# EAGLE design untitled (EAGLE 7.5.0)
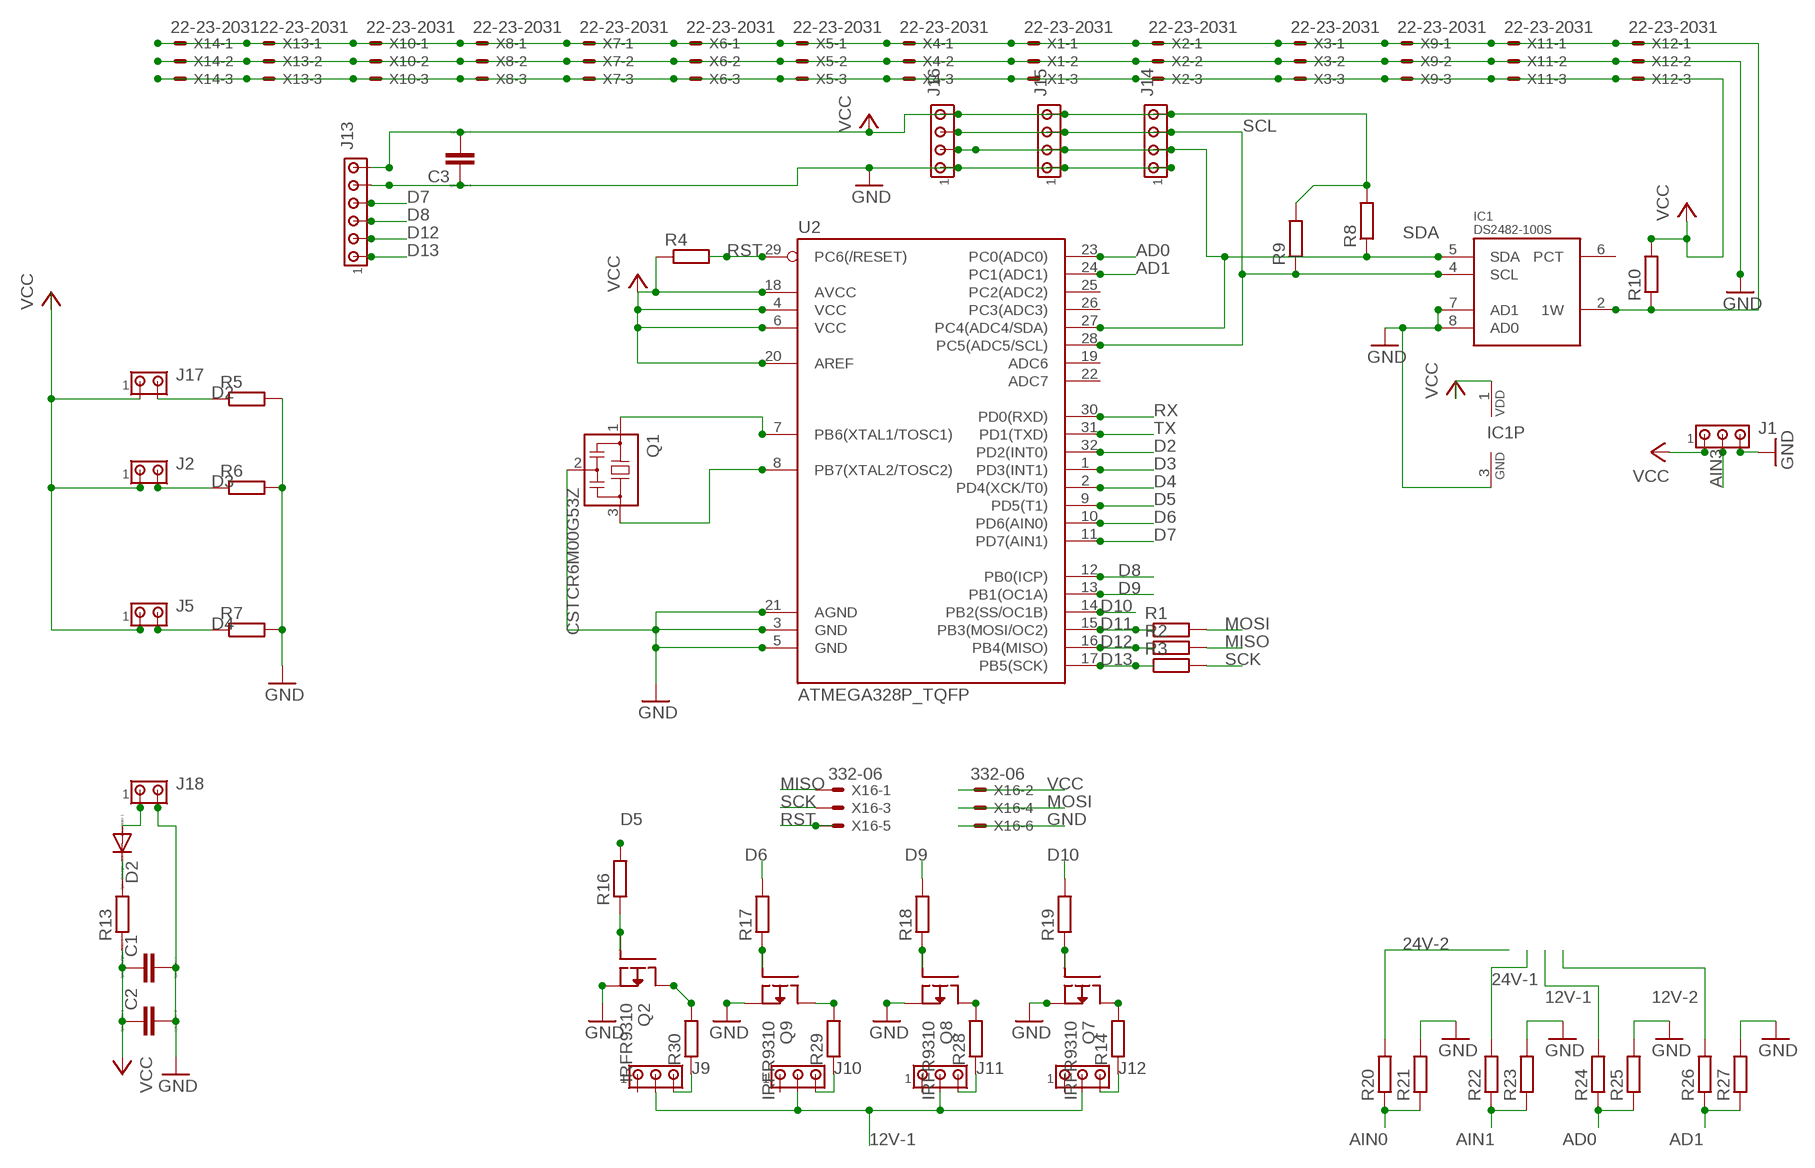
[diagram p0: schematic, sheet 1, part 1 of 2]
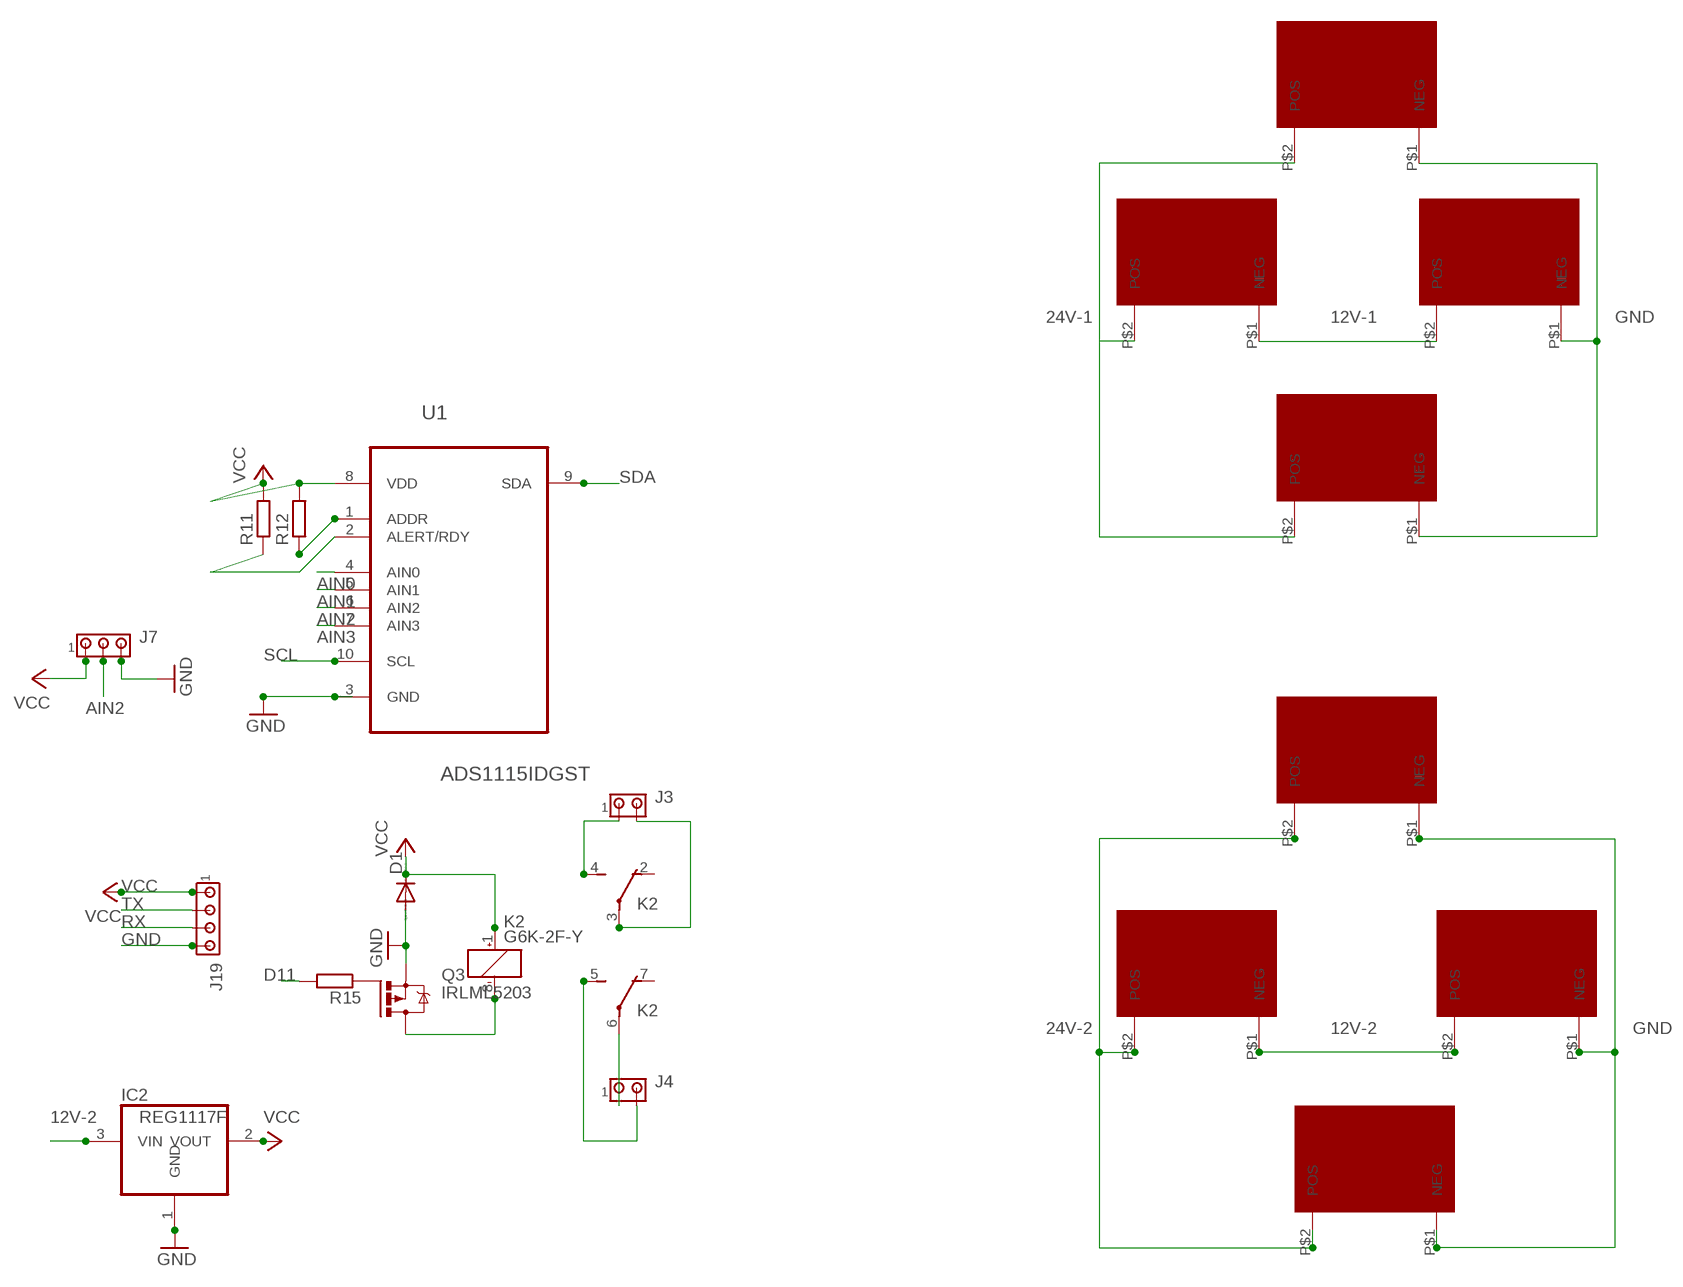
[diagram p1: schematic, sheet 1, part 2 of 2]

## Parts
C1  CC1206  [C1206]
C2  CC1206  [C1206]
C3  CC1206  [C1206]
D1  DIODE-DO214AA  [DO214AA]
D2  DIODE-DO214AA  [DO214AA]
IC1  DS2482-100S  [SO08]
IC2  REG1117F  [DD-3]
J1  MTA03-100  [10X03MTA]
J2  MTA02-100  [10X02MTA]
J3  MTA02-100  [10X02MTA]
J4  MTA02-100  [10X02MTA]
J5  MTA02-100  [10X02MTA]
J7  MTA03-100  [10X03MTA]
J9  MTA03-100  [10X03MTA]
J10  MTA03-100  [10X03MTA]
J11  MTA03-100  [10X03MTA]
J12  MTA03-100  [10X03MTA]
J13  MTA06-100  [10X06MTA]
J14  MTA04-100  [10X04MTA]
J15  MTA04-100  [10X04MTA]
J16  MTA04-100  [10X04MTA]
J17  MTA02-100  [10X02MTA]
J18  MTA02-100  [10X02MTA]
J19  MTA04-100  [10X04MTA]
K2  G6K-2F-Y  [G6K-2F-Y]
Q1  CSTCR6M00G53Z  [CSTCR6M]
Q2  IRFR9310  [TO252]
Q3  IRLML5203  [MICRO3]
Q7  IRFR9310  [TO252]
Q8  IRFR9310  [TO252]
Q9  IRFR9310  [TO252]
R1  R-EU_R0603  [R0603]
R2  R-EU_R0603  [R0603]
R3  R-EU_R0603  [R0603]
R4  R-EU_R0603  [R0603]
R5  R-EU_R0603  [R0603]
R6  R-EU_R0603  [R0603]
R7  R-EU_R0603  [R0603]
R8  R-EU_R0603  [R0603]
R9  R-EU_R0603  [R0603]
R10  R-EU_R0603  [R0603]
R11  R-EU_R0603  [R0603]
R12  R-EU_R0603  [R0603]
R13  RR2010  [R2010]
R14  R-EU_M1206  [M1206]
R15  R-EU_R0603  [R0603]
R16  R-EU_R0603  [R0603]
R17  R-EU_R0603  [R0603]
R18  R-EU_R0603  [R0603]
R19  R-EU_R0603  [R0603]
R20  R-EU_R0603  [R0603]
R21  R-EU_R0603  [R0603]
R22  R-EU_R0603  [R0603]
R23  R-EU_R0603  [R0603]
R24  R-EU_R0603  [R0603]
R25  R-EU_R0603  [R0603]
R26  R-EU_R0603  [R0603]
R27  R-EU_R0603  [R0603]
R28  R-EU_M1206  [M1206]
R29  R-EU_M1206  [M1206]
R30  R-EU_M1206  [M1206]
U1  ADS1115IDGST  [SOP50P490X110-10N]
U2  ATMEGA328P_TQFP  [TQFP32-08]
U$1  XT60  [XT60]
U$2  XT60  [XT60]
U$3  XT60  [XT60]
U$4  XT60  [XT60]
U$5  XT60  [XT60]
U$6  XT60  [XT60]
U$7  XT60  [XT60]
U$8  XT60  [XT60]
X1  22-23-2031  [22-23-2031]
X2  22-23-2031  [22-23-2031]
X3  22-23-2031  [22-23-2031]
X4  22-23-2031  [22-23-2031]
X5  22-23-2031  [22-23-2031]
X6  22-23-2031  [22-23-2031]
X7  22-23-2031  [22-23-2031]
X8  22-23-2031  [22-23-2031]
X9  22-23-2031  [22-23-2031]
X10  22-23-2031  [22-23-2031]
X11  22-23-2031  [22-23-2031]
X12  22-23-2031  [22-23-2031]
X13  22-23-2031  [22-23-2031]
X14  22-23-2031  [22-23-2031]
X16  332-06  [332-06]

## Nets
12V-1: J9.2 J10.2 J11.2 J12.2 R24.2 U$1.P$1(NEG) U$2.P$2(POS)
12V-2: IC2.3(VIN) R26.2 U$6.P$1(NEG) U$7.P$2(POS)
24V-1: R22.2 U$1.P$2(POS) U$3.P$2(POS) U$4.P$2(POS)
24V-2: R20.2 U$5.P$2(POS) U$6.P$2(POS) U$8.P$2(POS)
AD0: R24.1 R25.1 U2.23(PC0(ADC0))
AD1: R26.1 R27.1 U2.24(PC1(ADC1))
AIN0: R20.1 R21.1 U1.4(AIN0)
AIN1: R22.1 R23.1 U1.5(AIN1)
AIN2: J7.2 U1.6(AIN2)
AIN3: J1.2 U1.7(AIN3)
D2: J17.2 R5.1 U2.32(PD2(INT0))
D3: J2.2 R6.1 U2.1(PD3(INT1))
D4: J5.2 R7.1 U2.2(PD4(XCK/T0))
D5: R16.2 U2.9(PD5(T1))
D6: R17.2 U2.10(PD6(AIN0))
D7: J13.4 U2.11(PD7(AIN1))
D8: J13.3 U2.12(PB0(ICP))
D9: R18.2 U2.13(PB1(OC1A))
D10: R19.2 U2.14(PB2(SS/OC1B))
D11: R1.1 R15.2 U2.15(PB3(MOSI/OC2))
D12: J13.2 R2.1 U2.16(PB4(MISO))
D13: J13.1 R3.1 U2.17(PB5(SCK))
GND: C1.2 C2.2 C3.1 D1.A IC1.3(GND) IC1.7(AD1) IC1.8(AD0) IC2.1(GND) J1.3 J7.3 J13.5 J14.1 J15.1 J16.1 J18.2 J19.4 Q1.2 Q2.2(S) Q3.2(S) Q7.2(S) Q8.2(S) Q9.2(S) R5.2 R6.2 R7.2 R21.2 R23.2 R25.2 R27.2 U1.3(GND) U2.3(GND) U2.5(GND) U2.21(AGND) U$2.P$1(NEG) U$3.P$1(NEG) U$4.P$1(NEG) U$5.P$1(NEG) U$7.P$1(NEG) U$8.P$1(NEG) X1.2 X2.2 X3.2 X4.2 X5.2 X6.2 X7.2 X8.2 X9.2 X10.2 X11.2 X12.2 X13.2 X14.2 X16.6
MISO: R2.2 X16.1
MOSI: R1.2 X16.4
N$1: IC1.2(1W) R10.1 X1.1 X2.1 X3.1 X4.1 X5.1 X6.1 X7.1 X8.1 X9.1 X10.1 X11.1 X12.1 X13.1 X14.1
N$2: Q1.1 U2.7(PB6(XTAL1/TOSC1))
N$3: Q1.3 U2.8(PB7(XTAL2/TOSC2))
N$6: J9.3 R30.1
N$7: Q3.1(G) R15.1
N$8: K2.8(1:-) Q3.3(D)
N$9: Q9.3(D) R29.2
N$10: Q2.3(D) R30.2
N$11: Q8.3(D) R28.2
N$12: Q7.3(D) R14.2
N$13: R12.1 U1.1(ADDR)
N$14: J3.1 K2.4(2:S)
N$15: R11.1 U1.2(ALERT/RDY)
N$16: J10.3 R29.1
N$17: J11.3 R28.1
N$18: J12.3 R14.1
N$19: J3.2 K2.3(2:P)
N$20: J4.1 K2.6(3:P)
N$21: J4.2 K2.5(3:S)
N$22: D2.A J18.1
N$23: D2.C R13.2
N$26: Q2.1(G) R16.1
N$27: Q9.1(G) R17.1
N$28: Q8.1(G) R18.1
N$29: Q7.1(G) R19.1
RST: R4.2 U2.29(PC6(/RESET)) X16.5
RX: J19.3 U2.30(PD0(RXD))
SCK: R3.2 X16.3
SCL: IC1.4(SCL) J14.3 J15.3 J16.3 R9.1 U1.10(SCL) U2.28(PC5(ADC5/SCL))
SDA: IC1.5(SDA) J14.2 J15.2 J16.2 R8.1 U1.9(SDA) U2.27(PC4(ADC4/SDA))
TX: J19.2 U2.31(PD1(TXD))
VCC: C1.1 C2.1 C3.2 D1.C IC1.1(VDD) IC2.2(VOUT) J1.1 J2.1 J5.1 J7.1 J13.6 J14.4 J15.4 J16.4 J17.1 J19.1 K2.1(1:+) R4.1 R8.2 R9.2 R10.2 R11.2 R12.2 R13.1 U1.8(VDD) U2.4(VCC) U2.6(VCC) U2.18(AVCC) U2.20(AREF) X1.3 X2.3 X3.3 X4.3 X5.3 X6.3 X7.3 X8.3 X9.3 X10.3 X11.3 X12.3 X13.3 X14.3 X16.2
Unconnected: IC1.6(PCT) J9.1 J10.1 J11.1 J12.1 K2.2(2:O) K2.7(3:O) U2.19(ADC6) U2.22(ADC7) U2.25(PC2(ADC2)) U2.26(PC3(ADC3))

## Library data of the parts
C1-C3 = eagle-ltspice:C: CAPACITOR, European symbol; SPICEMODEL: NONE; SPICEPREFIX: C
D1 D2 = diode:DIODE-: DIODE
IC1 = 1wire:DS2482-100: I2C to 1-Wire Host Adapter/Line Driver This device is a onewire host and I2C interface in one chip. It provides the complete DC/AC requirements for onewire communication, including overdrive speed mode, but, unlike the DS2480B chip, no 12V EPROM programming. Notes: For overdrive speed and 5V EEPROM programming, an external active pullup circuit must be connected to the 1W, VDD and PCT pin. See the datasheet for details. The lower two I2C adress bits of the chip can be selected by external pins, so up to 4 chips may be connected to the same I2C bus. Author: Orginal device and description from Giovanni Varasano <giovanni.varasano@fastwebnet.it> Improved by Jan Kandziora <jjj@gmx.de>
IC2 = burr-brown:REG1117: 800mA and 1A Low Dropout (LDO) Positive Regulator 1.8V, 2.5V, 2.85V, 3.3V, 5V, and Adj; MF: TEXAS INSTRUMENTS; MPN: REG1117FAKTTT; OC_FARNELL: 1296120; OC_NEWARK: 87H2562
J1 J7 J9-J12 = con-amp:MTA03-100: AMP connector
J2-J5 J17 J18 = con-amp:MTA02-100: AMP connector
J13 = con-amp:MTA06-100: AMP connector Connection corrected 2014-09-19
J14-J16 J19 = con-amp:MTA04-100: AMP connector
K2 = relay:G6K: Low Signal Relay oeiwcsnts1.omron.com/.. D20G6K0100.pdf; MF: OMRON COMPONENTS USA; MPN: G6K-2F-Y DC3; OC_FARNELL: 1690316; OC_NEWARK: 89C6451
Q1 = murata-filter:CSTCR: Resonator Source: murata.co.jp; MPN: CSTCR6M00G53-R0; OC_FARNELL: 1170434; OC_NEWARK: 25M8759
Q2 Q7-Q9 = mosfet:IRFR9310: MOSFET, P, -400V, -1.8A, D-PAK IRFR9310 Parameters MOSFET, P, -400V, -1.8A, D-PAK Transistor Polarity: P Channel Continuous Drain Current Id: 1.8A Drain Source Voltage Vds: 400V On Resistance Rds(on): 7ohm Rds(on) Test Voltage Vgs: -10V Threshold Voltage Vgs: -4V Power Dissipation Pd: 50W Operating Temperature Min: -55°C Operating Temperature Max: 150°C Transistor Case Style: TO-252 No. of Pins: 3 MSL: MSL 1 - Unlimited Alternate Case Style: D-PAK Current Id Max: -1.8A Current Temperature: 25°C External Depth: 10.5mm External Length / Height: 2.55mm External Width: 6.8mm Full Power Rating Temperature: 25°C Junction to Case Thermal Resistance A: 2.5°C/W No. of Transistors: 1 Operating Temperature Range: -55°C to +150°C Pulse Current Idm: 7.2A Termination Type: SMD Voltage Vds Typ: -400V Voltage Vgs Max: 20V Voltage Vgs Rds on Measurement: -10V; MPN: IRFR9310PBF; OC_FARNELL: 8649910; PACKAGE: D-PACK; SUPPLIER: VISHAY
Q3 = transistor-power:IRLML5203: HEXFET P-Channel Power MOSFET
R1-R12 R15-R27 = resistor:R-EU_: RESISTOR, European symbol
R13 = eagle-ltspice:R: RESISTOR, European symbol; SPICEMODEL: NONE; SPICEPREFIX: R
R14 R28-R30 = rcl:R-EU_: RESISTOR, European symbol
U1 = Texas Instruments_By_element14_Batch_1:ADS1115IDGST: Analog-to-Digital Converter with Internal Reference; MPN: ADS1115IDGST; OC_FARNELL: 1762981; OC_NEWARK: 25R1241; PACKAGE: MSOP-10; SUPPLIER: Texas Instruments
U2 = SparkFun-DigitalIC:ATMEGA328P_TQFP; PROD_ID: IC-09069
U$1-U$8 = hans:XT60
X1-X14 = con-molex:22-23-2031: .100" (2.54mm) Center Header - 3 Pin; MF: MOLEX; MPN: 22-23-2031; OC_FARNELL: 1462950; OC_NEWARK: 30C0862
X16 = con-garry:332-06: 6 Pin - 2mm Dual Row Source: www.mpe-connector.de / garry_shortform_2012.pdf

## Net classes
0 default: width 0.152 mm, drill 0.508 mm, clearance 0.102 mm
1 supply: width 0.305 mm, drill 0.508 mm, clearance 0.203 mm

## Board
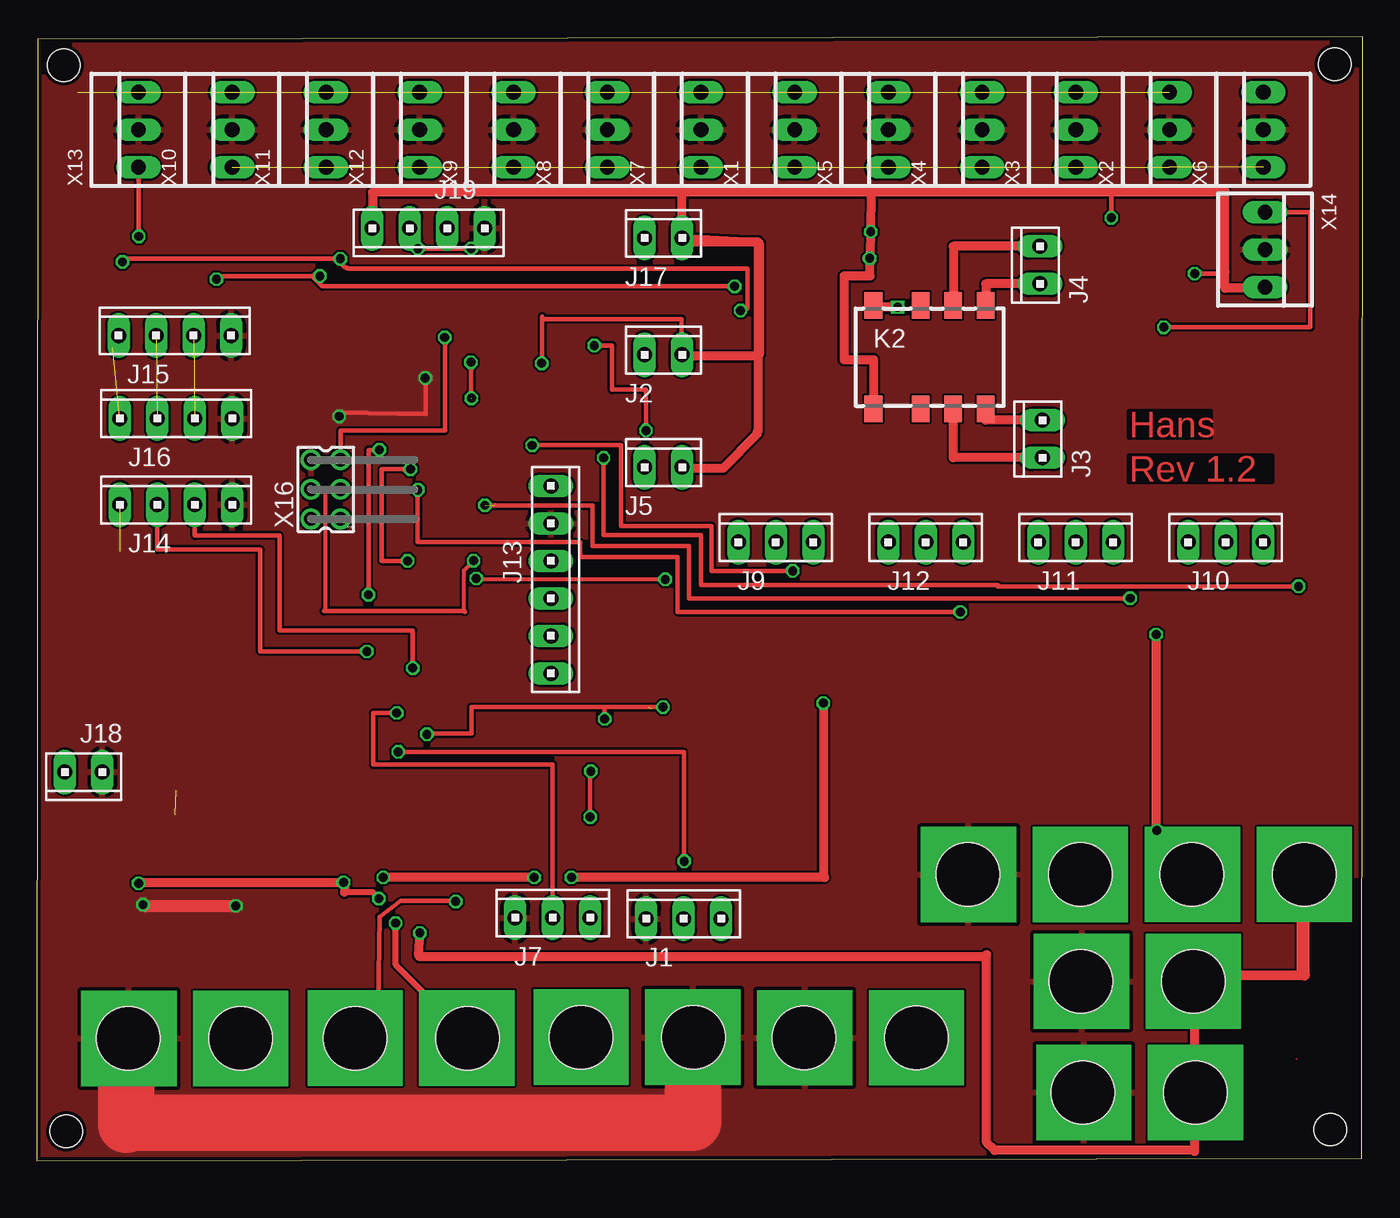
[diagram p2: board, top side]
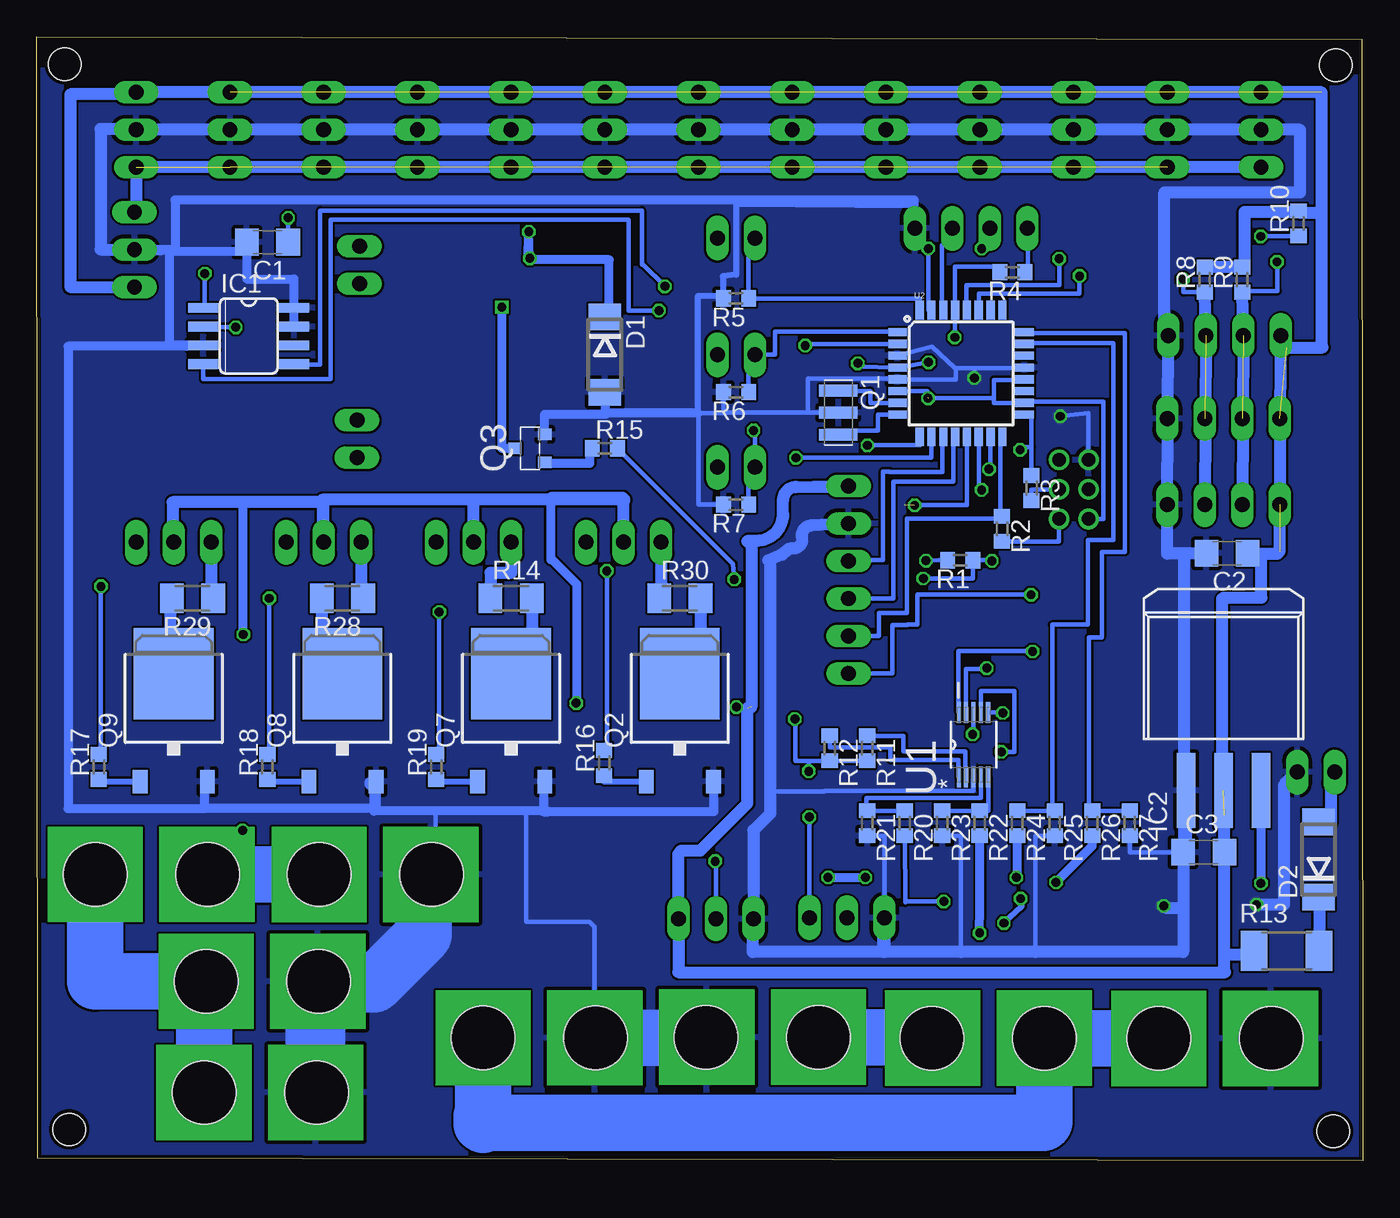
[diagram p3: board, bottom side, seen from below]

Size 89.82 x 76.15 mm. Coordinates in mm from the lower left corner, seen from the top.
Outline: 0,0 89.77,0.15 89.82,76.15 0.05,76 0,0
Copper layers (1*16): Top 0.035mm / dielectric 1.5mm / Bottom 0.035mm
Design rules "SeeedStudio_2layer_DRU_no_angle_20140221": minimum track width 6mil, minimum drill 12mil, track to track 6mil, track to pad 6mil, pad to pad 6mil, via to via 6mil, smd to smd 0mil, copper to edge 10mil, drill to drill 10mil, minimum pad ring 10mil, minimum via ring 6mil, stop-mask expansion 2mil, vias tented up to drill 100mil, thermal gap 10mil
Holes 2.2 mm at 1.82,74.23 87.94,74.3 87.63,2.11 1.98,1.99

### Footprints (pad centres in the part's own frame; a part is rotated, then mirrored left to right if it is on the bottom)
C1206 = smd 1.6 x 1.8: 1 -1.4,0; 2 1.4,0
DO214AA = smd 1.8 x 2.2: A 2.55,0; C -2.55,0
SO08 = smd 0.66 x 2.032: 1 -1.905,-3.073; 2 -0.635,-3.073; 3 0.635,-3.073; 4 1.905,-3.073; 5 1.905,3.073; 6 0.635,3.073; 7 -0.635,3.073; 8 -1.905,3.073
DD-3 = smd 1.27 x 5.08: 1 -2.54,-7.938; 2 0,-7.938; 3 2.54,-7.938
10X03MTA = drill 1.016 long: 1 2.54,0; 2 0,0; 3 -2.54,0
10X02MTA = drill 1.016 long: 1 1.27,0; 2 -1.27,0
10X06MTA = drill 1.016 long: 1 6.35,0; 2 3.81,0; 3 1.27,0; 4 -1.27,0; 5 -3.81,0; 6 -6.35,0
10X04MTA = drill 1.016 long: 1 3.81,0; 2 1.27,0; 3 -1.27,0; 4 -3.81,0
G6K-2F-Y = smd 1.2 x 1.8: 1 -3.8,-3.5; 2 -0.6,-3.5; 3 1.6,-3.5; 4 3.8,-3.5; 5 3.8,3.5; 6 1.6,3.5; 7 -0.6,3.5; 8 -3.8,3.5
CSTCR6M = smd 0.8 x 2.6: 1 -1.5,0; 2 0,0; 3 1.5,0
TO252 = smd 1 x 1.6: 1 -2.28,-4.8; 2 2.28,-4.8 | smd 5.4 x 6.2: 3 0,2.5
MICRO3 = smd 0.8 x 0.9: 1 -0.95,-1; 2 0.95,-1; 3 0,1
R0603 = smd 1 x 1.1: 1 -0.85,0; 2 0.85,0
R2010 = smd 1.8 x 2.7: 1 -2.2,0; 2 2.2,0
M1206 = smd 1.6 x 2: 1 -1.4,0; 2 1.4,0
SOP50P490X110-10N = smd 1.422 x 0.279: 1 -2.184,0.991; 2 -2.184,0.508; 3 -2.184,0; 4 -2.184,-0.508; 5 -2.184,-0.991; 6 2.184,-0.991; 7 2.184,-0.508; 8 2.184,0; 9 2.184,0.508; 10 2.184,0.991
TQFP32-08 = smd 1.27 x 0.559: 1 -4.293,2.8; 2 -4.293,2; 3 -4.293,1.2; 4 -4.293,0.4; 5 -4.293,-0.4; 6 -4.293,-1.2; 7 -4.293,-2; 8 -4.293,-2.8; 17 4.293,-2.8; 18 4.293,-2; 19 4.293,-1.2; 20 4.293,-0.4; 21 4.293,0.4; 22 4.293,1.2; 23 4.293,2; 24 4.293,2.8 | smd 0.559 x 1.27: 9 -2.8,-4.293; 10 -2,-4.293; 11 -1.2,-4.293; 12 -0.4,-4.293; 13 0.4,-4.293; 14 1.2,-4.293; 15 2,-4.293; 16 2.8,-4.293; 25 2.8,4.293; 26 2,4.293; 27 1.2,4.293; 28 0.4,4.293; 29 -0.4,4.293; 30 -1.2,4.293; 31 -2,4.293; 32 -2.8,4.293
XT60 = drill 4.3 pad 6.452 square: P$1 3.76,0; P$2 -3.81,0 | hole 4.3: 3.81,0; -3.81,0
22-23-2031 = drill 1 long: 1 -2.54,0; 2 0,0; 3 2.54,0
332-06 = drill 0.9 pad 1.27: 1 -2,-1; 2 -2,1; 3 0,-1; 4 0,1; 5 2,-1; 6 2,1

### Placement (x,y rotation side)
C1  74.2,62.24 180 bottom
C2  9.18,41.16 180 bottom
C3  10.76,20.9 0 bottom
D1  51.34,54.62 270 bottom
D2  2.97,20.41 90 bottom
IC1  75.47,55.89 270 bottom
IC2  9.43,33.03 0 bottom
J1  43.82,16.4 0 top
J2  42.45,54.62 0 top
J3  68.14,48.9 90 top
J4  67.96,60.7 90 top
J5  42.45,47 0 top
J7  34.95,16.46 0 top
J9  50.07,41.92 0 top
J10  80.55,41.92 0 top
J11  70.39,41.92 0 top
J12  60.23,41.92 0 top
J13  34.83,39.38 270 top
J14  9.43,44.46 0 top
J15  9.35,55.91 0 top
J16  9.43,50.3 0 top
J17  42.45,62.52 0 top
J18  3.16,26.34 180 top
J19  26.53,63.19 180 top
K2  60.49,54.45 0 top
Q1  35.52,50.69 270 bottom
Q2  46.26,30.49 0 bottom
Q3  56.42,48.27 90 bottom
Q7  57.69,30.49 0 bottom
Q8  69.12,30.49 0 bottom
Q9  80.55,30.49 0 bottom
R1  27.26,40.69 180 bottom
R2  24.44,42.82 270 bottom
R3  22.44,45.58 270 bottom
R4  23.73,60.2 180 bottom
R5  42.45,58.43 180 bottom
R6  42.45,52.08 180 bottom
R7  42.45,44.46 180 bottom
R8  10.7,59.7 90 bottom
R9  8.16,59.7 90 bottom
R10  4.35,63.51 90 bottom
R11  33.56,27.95 270 bottom
R12  36.1,27.95 270 bottom
R13  5.15,14.22 0 bottom
R14  57.69,38.11 0 bottom
R15  51.34,48.27 0 bottom
R16  51.39,26.95 90 bottom
R17  85.63,26.68 90 bottom
R18  74.2,26.68 90 bottom
R19  62.77,26.68 90 bottom
R20  31.02,22.87 270 bottom
R21  33.56,22.87 270 bottom
R22  25.94,22.87 270 bottom
R23  28.48,22.87 270 bottom
R24  23.4,22.87 270 bottom
R25  20.86,22.87 270 bottom
R26  18.32,22.87 270 bottom
R27  15.78,22.87 270 bottom
R28  69.12,38.11 180 bottom
R29  79.28,38.11 180 bottom
R30  46.26,38.11 0 bottom
U1  26.36,28.19 90 bottom
U2  27.21,53.35 0 bottom
U$1  82.07,19.39 180 top
U$2  66.89,19.39 180 top
U$3  74.55,12.15 180 top
U$4  74.69,4.62 180 top
U$5  55.79,8.33 180 top
U$6  25.38,8.3 0 top
U$7  40.69,8.38 0 top
U$8  9.99,8.28 180 top
X1  51.34,69.86 90 top
X2  76.74,69.86 90 top
X3  70.39,69.86 90 top
X4  64.04,69.86 90 top
X5  57.69,69.86 90 top
X6  83.09,69.86 90 top
X7  44.99,69.86 90 top
X8  38.64,69.86 90 top
X9  32.29,69.86 90 top
X10  13.24,69.86 90 top
X11  19.59,69.86 90 top
X12  25.94,69.86 90 top
X13  6.89,69.86 90 top
X14  83.21,61.74 270 top
X16  19.57,45.49 90 top

### Tracks (layer width: path | path; a pad name or v marks a point on that pad's centre or on a via)
12V-1  (via drill 0.6)
  Top 0.61: v53.28,31.01 53.28,19.29 53.38,19.2 v36.21,19.2 | v33.69,19.2 v23.46,19.2 23.4,19.13 | v75.89,22.38 75.84,22.43 v75.84,35.66
  Bottom 0.61: J9.2 50.05,41.92 50.05,45 55.01,45 55.01,40.73 54.91,40.73 53.25,39.07 53.25,31.04 v53.28,31.01 | v36.21,19.2 v33.69,19.2 | v23.46,19.2 23.4,19.26 R24.2 | U$2.P$2 71.6,20.3 76.08,20.3 75.89,20.49 v75.89,22.38 | v75.84,35.66 75.84,44.63
  Bottom 0.813: J9.2 50.07,44.75 50.02,44.75 50.02,44.81 60.26,44.81 60.26,41.92 J12.2 60.23,44.78 70.47,44.78 70.47,41.92 J11.2 70.39,44.63 75.84,44.63 80.62,44.63 80.62,41.92 J10.2
  Bottom 3.81: U$1.P$1 U$2.P$2
12V-2  (via drill 0.6)
  Top 0.406: v28.46,9.12 24.3,13.28 v24.3,16.1 | v23.17,17.75 22.76,18.19 20.84,18.19
  Top 0.61: v6.89,18.79 6.96,18.86 v20.77,18.86 20.84,18.79 20.84,18.19
  Bottom 0.305: 29.21,8.38 v28.46,9.12
  Bottom 0.406: v24.3,16.1 23.09,17.24 v23.17,17.75
  Bottom 0.61: IC2.3 v6.89,18.79 | v20.77,18.86 18.32,21.32 R26.2
  Bottom 3.81: U$7.P$2 29.21,8.38 U$6.P$1
24V-1  (via drill 0.6)
  Top 0.61: U$3.P$2 78.78,12.57 85.96,12.57 85.68,12.85 85.68,16.83 85.89,16.62 85.89,12.5 85.82,12.57 78.36,12.57 78.43,12.5 78.43,0.63 78.36,0.7 64.91,0.7 64.35,1.26 64.35,13.97 64.21,13.83 25.93,13.83 25.86,13.9 v25.95,15.43
  Bottom 0.61: v25.95,15.43 25.94,17.18 R22.2
  Bottom 3.81: U$1.P$2 85.88,12.15 U$3.P$2 78.5,12.15 U$4.P$2
24V-2  (via drill 0.6)
  Top 0.305: v28.37,17.57 28.34,17.6 24.65,17.6 23.22,16.53 23.08,8.66 22.72,8.3 U$6.P$2
  Bottom 0.305: R20.2 30.99,17.5 30.92,17.57 v28.37,17.57
  Bottom 3.81: U$8.P$2 13.83,8.3 U$6.P$2 21.57,2.63 21.61,2.58 59.47,2.58 59.61,2.44 59.68,2.51 59.68,3 59.6,3.08 U$5.P$2
AD0
  Bottom 0.305: U2.23 22.92,55.39 16.89,55.39 16.89,42.04 18.6,42.04 18.6,36.33 21.02,36.33 21.02,23.72 R25.1 R24.1
AD1
  Bottom 0.305: U2.24 22.92,56.09 16.11,56.09 16.11,41.25 17.67,41.25 17.67,35.46 18.54,35.46 18.54,23.72 R26.1 R27.1
AIN0
  Bottom 0.305: U1.4 25.85,24.58 33.63,24.58 33.63,23.72 R21.1 R20.1
AIN1
  Bottom 0.305: U1.5 25.37,23.72 R22.1 R23.1
AIN2  (via drill 0.6)
  Top 0.305: v24.38,30.34 22.8,30.34 22.8,26.84 34.95,26.84 J7.2
  Bottom 0.305: U1.6 24.38,30.37 v24.38,30.34
AIN3  (via drill 0.6)
  Top 0.305: v43.86,20.29 43.83,27.68 v24.48,27.71
  Bottom 0.305: J1.2 43.82,20.66 v43.86,20.29 | v24.48,27.71 23.6,27.68 23.6,31.82 25.85,31.82 U1.7
D2
  Bottom 0.305: U2.32 30.01,58.43 R5.1 41.6,62.24 J17.2
D3
  Bottom 0.305: R6.1 41.6,54.62 J2.2 39.81,54.62 39.81,56.19 31.5,56.19 U2.1
D4  (via drill 0.6)
  Top 0.305: v41.27,49.48 41.27,52.25 38.98,52.25 38.98,55.24 v37.76,55.24
  Bottom 0.305: v41.27,49.48 41.18,49.48 J5.2 41.6,47 R7.1 | v37.76,55.24 37.76,55.35 U2.2
D5  (via drill 0.6)
  Top 0.305: v33.55,48.48 39.57,48.48 39.57,43.02 45.7,43.02 45.7,39.97 v51.21,39.97
  Bottom 0.305: U2.9 30.01,48.48 v33.55,48.48 | v51.21,39.97 51.21,27.8 R16.2
D6  (via drill 0.6)
  Top 0.305: v38.4,47.63 38.4,42.4 44.98,42.4 44.98,38.99 65.11,38.99 65.11,38.92 v85.48,38.92
  Bottom 0.305: U2.10 29.21,47.63 v38.4,47.63 | v85.48,38.92 85.48,27.53 R17.2
D7
  Bottom 0.305: J13.4 34.83,40.69 32.49,40.69 32.49,46.71 32.05,46.71 32.05,46.67 28.47,46.67 28.47,49.06 U2.11
D8
  Bottom 0.305: J13.3 31.79,38.11 31.79,46.01 27.73,46.01 27.73,49.06 U2.12
D9  (via drill 0.6)  (1 unrouted)
  Top 0.305: 31.05,44.42 31.05,44.38 | v74.08,38.11 44.19,38.11 44.19,41.65 37.66,41.65 37.66,44.38 30.35,44.38 v30.35,44.41
  Bottom 0.305: U2.13 26.81,44.41 v30.35,44.41 | v74.08,38.11 74.08,27.53 R18.2
D10  (via drill 0.6)
  Top 0.305: v25.81,45.45 25.81,41.91 36.81,41.91 36.81,40.91 43.41,40.91 43.41,37.19 v62.57,37.19
  Bottom 0.305: U2.14 26.01,45.45 v25.81,45.45 | v62.57,37.19 62.57,27.53 R19.2
D11  (via drill 0.6)
  Top 0.305: v25.31,46.86 23.37,46.86 23.37,40.64 v25.11,40.64 | v29.76,39.45 29.76,39.4 v42.57,39.39
  Bottom 0.305: U2.15 25.21,46.86 v25.31,46.86 | v25.11,40.64 25.11,40.69 R1.1 26.41,39.45 v29.76,39.45 | v42.57,39.39 42.65,40.43 R15.2
D12
  Bottom 0.305: U2.16 24.41,49.09 24.55,49.09 24.55,43.67 R2.1 24.43,43.52 30.87,43.52 30.87,37.12 32.77,37.12 32.77,35.57 J13.2
D13  (via drill 0.6)
  Top 0.305: v22.46,38.35 22.46,48.17 v23.2,48.17
  Bottom 0.305: J13.1 31.87,33.03 31.87,36.3 30.84,36.3 30.84,36.33 30.17,36.33 30.17,38.35 v22.46,38.35 | R3.1 22.44,48.35 | 22.44,48.35 22.44,50.55 U2.17 | v23.2,48.17 23.2,48.35 22.44,48.35
GND  (via drill 0.6)
  Top 0.305: v20.48,50.44 20.48,50.69 26.33,50.6 26.33,53.04 v26.31,53.04
  Top 0.813: v7.18,17.35 7.26,17.27 v13.48,17.27
  Top 3.81: U$8.P$1 6.07,8.11 6.07,2.44 6.21,2.58 44.41,2.58 44.45,2.62 U$7.P$1
  Bottom 0.305: U2.21 22.92,53.72 26.31,53.72 | 26.31,53.72 27.54,53.72 | 27.54,53.72 27.61,53.72 29.17,55.15 U2.3 | 27.54,53.72 27.54,52.94 31.5,52.94 U2.5 31.5,52.99 37.59,52.99 37.59,50.69 | 35.52,50.73 Q1.2 37.59,50.69 | 37.59,50.69 43.29,50.69 | 43.29,50.69 R6.2 | 43.29,50.69 43.29,50.66 44.98,50.66 | 44.98,50.66 44.98,44.46 R7.2 | 43.3,58.58 R5.2 43.34,58.43 | 45.05,50.66 44.98,50.66 | J19.4 30.29,64.16 30.38,64.16 30.38,64.68 42.44,64.78 | X16.6 18.57,50.67 v20.48,50.44 | v26.31,53.04 26.31,53.72 | U1.3 26.36,25.05 36.45,25.05 36.45,25.02 40.15,25.02 | R21.2 32.41,22.02 J7.3 | R23.2 27.21,22.02 27.21,14.14 | R25.2 22.16,22.02 22.16,14.14 | C3.1 15.78,20.9 R27.2 | U$2.P$1 62.8,19.72 62.8,23.7 | U$7.P$1 44.49,8.33 52.14,8.33 52.05,8.43 52.05,15.84 52.39,16.18 56.65,16.18 56.7,16.23 56.7,23.7
  Bottom 0.406: 43.3,58.58 45.05,58.58 45.05,50.66 | 42.44,64.78 42.44,60.04 43.34,59.93 43.34,58.43
  Bottom 0.61: Q2.2 43.98,23.64 55.18,23.64 | Q7.2 55.5,25.69 55.5,23.64 55.18,23.64 | 55.18,23.64 55.18,23.7 56.7,23.7 62.8,23.7 66.98,23.7 66.98,25.45 67.3,25.45 67.3,25.69 Q8.2 66.84,23.86 78.46,23.86 | 78.46,23.86 78.46,25.69 Q9.2 | 80.85,61.59 80.85,61.73 81.33,61.73 81.33,61.67 83.21,61.67 X14.2 80.47,61.74 80.47,65.1 30.38,65.1 30.38,64.68 | 80.85,61.59 80.85,55.29 79.68,55.29 79.68,55.18 87.7,55.18 87.7,23.86 78.46,23.86 | Q3.2 55.42,50.59 51.28,50.59 | 51.28,50.59 51.28,52.07 D1.A | C1.2 75.6,61.59 | 75.6,61.59 80.85,61.59 | 75.6,61.59 75.6,59.74 72.42,59.74 72.42,56.52 IC1.7 | 45.05,50.66 51.21,50.66 51.28,50.59
  Bottom 0.813: IC2.1 11.97,20.9 C3.1 | C3.1 12.16,17.24 | C3.1 12.16,17.15 | 12.16,17.15 12.16,14.14 22.16,14.14 27.21,14.14 32.45,14.14 32.45,16.46 J7.3 32.41,14.14 41.31,14.14 41.31,16.4 J1.3 41.28,22.39 40.15,23.52 40.15,25.02 40.15,40.55 40.28,40.68 39.32,41.06 38.75,41.51 arc-118 37.98,42.21 arc98 37.35,43.04 J13.5 | C2.2 10.62,41.13 12.08,41.13 | 12.08,41.13 13.23,41.13 13.24,41.13 J14.1 J15.1 13.24,55.29 13.42,55.29 13.42,65.63 4.24,65.63 4.24,69.86 X13.2 X6.2 83.09,69.9 85.51,69.9 85.51,61.74 X14.2 | C3.1 12.08,20.98 12.08,41.13 | J18.2 5.33,25.45 5.33,17.35 v7.18,17.35 | v13.48,17.27 13.36,17.15 12.16,17.15
  Bottom 3.81: U$3.P$1 70.84,12.15 70.84,4.1 71.08,4.1 71.08,11.94 66.98,11.94 63.61,15.32 63.61,18.91 U$2.P$1 | U$5.P$1 44.5,8.32 U$7.P$1
  pour Top: 0,76 90,76 90,0 0,0
  pour Bottom: 0,76 90,76 90,0 0,0
MISO
  Bottom 0.305: 24.5,41.92 24.43,41.92 R2.2 20.57,41.97 X16.1
MOSI  (via drill 0.6)
  Top 0.254: 19.56,37.28 19.56,45.49 | 29,37.19 28.93,37.19 28.93,40.01 v29.58,40.66
  Top 0.305: 29,37.19 28.98,37.19 28.98,37.24 19.45,37.24 19.45,37.28 19.56,37.28 | 19.56,45.49 X16.4
  Bottom 0.305: R1.2 28.67,40.69 v29.58,40.66
N$1  (via drill 0.6)  (11 unrouted)
  Top 0.305: v6.9,62.63 6.89,62.65 X13.1 | v83.09,64.28 86.28,64.28 86.28,56.48 v76.35,56.48
  Bottom 0.305: R10.1 4.37,62.63 v6.9,62.63 | v76.35,56.48 78.54,56.48 IC1.2
  Bottom 0.813: X13.1 X6.1 v83.09,64.28 X14.1
N$2
  Bottom 0.305: Q1.1 35.52,52.15 33.36,52.15 33.36,51.35 U2.7
N$3
  Bottom 0.305: Q1.3 36.31,49.18 36.31,49.48 32.83,49.48 32.83,50.55 U2.8
N$6
  Bottom 0.813: J9.3 47.53,38.11 R30.1
N$7
  Bottom 0.61: Q3.1 55.42,47.26 52.35,47.26 52.35,48.27 R15.1
N$8  (via drill 0.6)
  Top 0.61: v58.32,57.84 56.69,57.84 K2.8
  Bottom 0.61: Q3.3 58.32,48.27 v58.32,57.84
N$9
  Bottom 0.813: R29.2 80.68,37.89 80.81,37.89 80.81,32.99 Q9.3
N$10
  Bottom 0.813: R30.2 44.86,32.99 Q2.3
N$11
  Bottom 0.813: R28.2 70.52,32.99 Q8.3
N$12
  Bottom 0.813: R14.2 56.29,32.99 Q7.3
N$13
  Bottom 0.305: R12.1 36.1,27.99 32.01,27.99 32.01,27.17 27.38,27.17 27.38,26 U1.1
N$14
  Top 0.61: J3.1 64.29,50.17 K2.4
N$15
  Bottom 0.305: R11.1 33.56,28.79 31.1,28.79 31.1,27.72 26.9,27.72 26.9,26.6 26.88,26.6 26.88,26 U1.2
N$16
  Bottom 0.813: J10.3 78.01,38.11 R29.1
N$17
  Bottom 0.813: J11.3 67.85,38.11 R28.1
N$18
  Bottom 0.813: J12.3 57.69,39.83 59.09,39.83 R14.1
N$19
  Top 0.61: J3.2 62.09,47.63 K2.3
N$20
  Top 0.61: J4.1 62.09,61.97 K2.6
N$21
  Top 0.61: J4.2 64.29,59.43 K2.5
N$22
  Bottom 0.813: J18.1 2.15,26.09 2.15,22.91 2.19,22.96 D2.A
N$23
  Bottom 0.813: D2.C 2.95,17.83 R13.2
N$26
  Bottom 0.406: R16.1 51.39,25.69 Q2.1
N$27
  Bottom 0.406: R17.1 85.63,25.69 Q9.1
N$28
  Bottom 0.406: R18.1 74.2,25.69 Q8.1
N$29
  Bottom 0.406: R19.1 62.77,25.69 Q7.1
RST  (via drill 0.6)
  Top 0.305: X16.5 20.57,49.47 27.65,49.47 27.65,55.79 v27.63,55.79
  Bottom 0.305: R4.2 24.33,60.57 27.61,60.57 U2.29 27.63,57.64 v27.63,55.79
RX
  Bottom 0.305: J19.3 27.75,62.03 28.5,62.03 28.5,57.64 U2.30
SCK
  Bottom 0.305: R3.2 22.44,45.49 X16.3
SCL  (via drill 0.6)  (1 unrouted)
  Top 0.305: v5.8,60.9 5.8,61.12 v20.56,61.12 arc90 21.24,60.44 48.13,60.44 48.13,57.79 arc-90 v47.67,57.61 | v22.36,34.51 15.13,34.51 15.13,41.4 8.16,41.4 J14.3
  Bottom 0.305: R9.1 8.16,58.93 5.77,58.93 5.77,60.9 v5.8,60.9 | v20.56,61.12 20.56,59.33 26.84,59.33 26.84,57.64 U2.28 | IC1.4 78.54,52.95 69.92,52.95 69.92,63.78 49.75,63.78 49.75,57.61 v47.67,57.61 | U1.10 27.38,30.37 27.38,34.53 22.36,34.53 v22.36,34.51
  Bottom 0.813: J14.3 J15.3 R9.1
SDA  (via drill 0.6)  (1 unrouted)
  Top 0.305: v12.17,59.73 12.17,59.95 18.64,59.95 | 18.64,59.95 v19.18,59.95 | v47.27,59.25 19.34,59.25 18.64,59.95 | v25.46,33.38 25.46,35.94 16.44,35.94 16.44,42.35 10.7,42.35 J14.2
  Bottom 0.305: R8.1 10.7,58.84 12.13,58.84 12.13,59.73 v12.17,59.73 | v19.18,59.95 19.18,58.75 26,58.75 U2.27 | IC1.5 72.39,53.95 70.63,53.95 70.63,64.38 48.83,64.38 48.83,60.72 48.74,60.72 v47.27,59.25 | U1.9 26.87,33.33 25.46,33.33 v25.46,33.38
  Bottom 0.813: J14.2 J15.2 R8.1
TX  (via drill 0.6)
  Top 0.305: v25.81,61.81 v29.43,61.81
  Bottom 0.305: J19.2 25.21,61.81 v25.81,61.81 | v29.43,61.81 29.43,57.64 U2.31
VCC  (via drill 0.6)  (17 unrouted)
  Top 0.305: v29.41,54.1 29.41,52.15 v29.45,51.67 | 34.23,57.2 34.23,57.03 | 34.23,57.03 34.23,53.89 v34.2,54.03 | J2.1 43.69,57.03 34.23,57.03 | v26.42,28.89 26.42,28.95 29.44,28.95 29.44,30.74 38.47,30.74 | 38.47,30.74 v42.42,30.74 | v38.47,29.93 38.47,30.74 | v37.49,23.29 37.49,26.39 v37.52,26.39 | v78.45,60.11 80.5,60.11 80.5,60.22 | v72.8,63.89 v72.81,63.89 72.81,65.61
  Top 0.61: X14.3 83.21,59.12 80.5,59.12 80.5,60.22 80.5,65.72 80.16,65.72 80.16,65.61 72.81,65.61 56.55,65.61 | 43.59,47 J5.1 43.8,46.91 46.47,46.91 48.8,49.24 48.8,49.37 48.85,49.37 48.85,62.27 43.83,62.27 43.83,62.29 43.72,62.29 J17.1 | 56.55,65.61 43.72,65.61 | 43.72,65.61 22.74,65.61 22.74,64.2 J19.1 | 56.55,65.61 v56.49,62.95 56.44,59.95 54.69,59.95 54.69,54.28 56.69,54.28 K2.1 | J17.1 43.72,65.61 | J17.1 48.75,62.24 48.77,62.26 48.83,62.26 48.94,62.16 48.94,54.64 48.83,54.53 43.8,54.53 J2.1 | v56.43,61.15 56.22,61.15
  Bottom 0.305: J19.1 22.67,60.48 R4.1 | v29.41,54.1 31.5,53.72 U2.4 34.2,53.8 v34.2,54.03 | v29.45,51.67 29.5,52.15 U2.6 | 18.57,43.36 X16.2 17.58,43.49 17.58,51.44 22.92,51.44 U2.18 24.98,51.35 24.98,51.67 | U2.20 22.92,52.9 24.98,52.9 24.98,51.67 | 29.41,51.67 24.98,51.67 | U1.8 26.36,28.89 v26.42,28.89 | v42.42,30.74 42.42,30.66 41.68,30.66 | R12.2 R11.2 37.52,27.09 | 37.52,27.09 38.43,27.09 38.43,29.93 v38.47,29.93 | J7.1 v37.49,23.29 | v37.52,26.39 37.52,27.09 | IC1.1 78.45,57.79 v78.45,60.11 | C1.1 v72.8,63.89
  Bottom 0.61: v56.43,61.15 v56.49,62.95 56.55,61.05 51.05,61.05 51.05,57.17 D1.C
  Bottom 0.813: 9.68,20.9 C3.2 | C3.2 9.36,23.45 9.5,23.45 | 41.68,30.66 41.68,24.22 44.88,21.03 46.15,21.03 46.36,20.76 J1.1 46.36,12.78 9.31,12.78 9.36,12.83 9.36,13.96 | J13.6 arc2 38.37,45.66 arc-90 39.26,44.77 39.26,43.81 arc90 41.05,42.02 41.62,42.02 41.68,41.96 41.42,41.69 41.42,30.74 | C2.1 7.81,41.13 7.81,41 7.68,41.13 6.85,41.13 | 6.85,41.13 5.77,41.13 5.62,41.28 J15.4 5.14,55.1 2.71,55.1 2.77,55.16 2.77,64.22 | IC2.2 9.51,25.17 9.51,38.07 9.42,38.16 6.85,38.16 6.85,41.13 | 2.77,64.22 2.77,72.39 2.78,72.4 X6.3 83.14,72.45 83.79,72.45 83.79,72.26 87.55,72.26 87.55,59.2 X14.3 | 2.77,64.22 4.21,64.22 R10.2 4.35,64.29 8,64.29 8,60.55 R9.2 R8.2 | 9.36,13.96 C3.2 | R13.1 7.62,13.96 9.36,13.96
(copper drawn outside any net)
  shapes: Top area x1

### Text on the board
Top: Hans | Rev 1.2